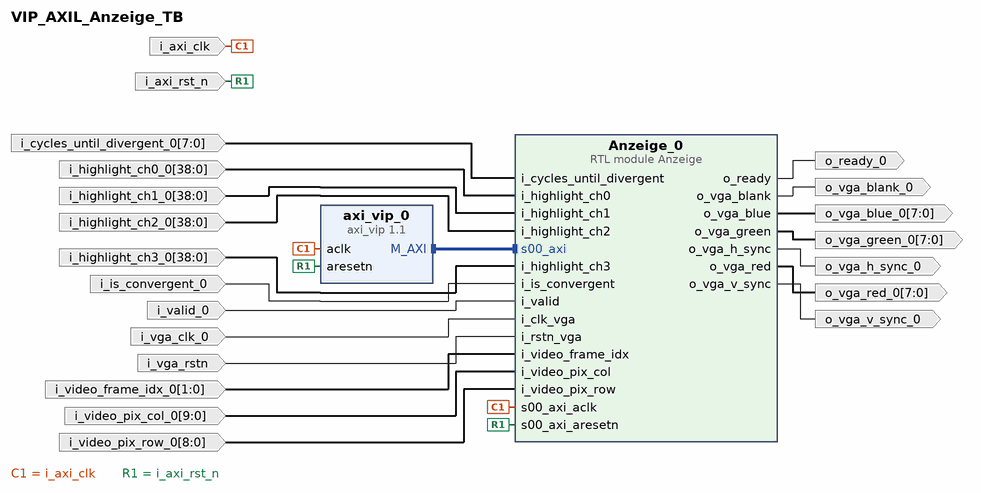
[diagram p0: block diagram of the top level]
# Vivado block design VIP_AXIL_Anzeige_TB, xc7z020clg400-1, Vivado 2023.2
create_bd_design VIP_AXIL_Anzeige_TB

create_bd_port -dir I -from 7 -to 0 i_cycles_until_divergent_0
create_bd_port -dir I i_is_convergent_0
create_bd_port -dir I -from 1 -to 0 i_video_frame_idx_0
create_bd_port -dir I -from 8 -to 0 i_video_pix_row_0
create_bd_port -dir I -from 9 -to 0 i_video_pix_col_0
create_bd_port -dir I i_valid_0
create_bd_port -dir O o_ready_0
create_bd_port -dir O o_vga_h_sync_0
create_bd_port -dir O o_vga_v_sync_0
create_bd_port -dir O o_vga_blank_0
create_bd_port -dir O -from 7 -to 0 o_vga_red_0
create_bd_port -dir O -from 7 -to 0 o_vga_green_0
create_bd_port -dir O -from 7 -to 0 o_vga_blue_0
create_bd_port -dir I -type clk i_vga_clk_0
set_property -dict {CONFIG.ASSOCIATED_RESET i_vga_rstn} [get_bd_ports i_vga_clk_0]
create_bd_port -dir I -type rst i_vga_rstn
set_property -dict {CONFIG.POLARITY ACTIVE_HIGH} [get_bd_ports i_vga_rstn]
create_bd_port -dir I -type clk i_axi_clk
set_property -dict {CONFIG.CLK_DOMAIN VIP_AXIL_Anzeige_TB_sim_clk_gen_1_0_clk CONFIG.FREQ_HZ 100000000} [get_bd_ports i_axi_clk]
create_bd_port -dir I -type rst i_axi_rst_n
create_bd_port -dir I -from 38 -to 0 i_highlight_ch0_0
create_bd_port -dir I -from 38 -to 0 i_highlight_ch1_0
create_bd_port -dir I -from 38 -to 0 i_highlight_ch3_0
create_bd_port -dir I -from 38 -to 0 i_highlight_ch2_0

create_bd_cell -type ip -vlnv xilinx.com:ip:axi_vip:1.1 axi_vip_0
set_property -dict [list \
  CONFIG.ADDR_WIDTH 32 \
  CONFIG.DATA_WIDTH 32 \
  CONFIG.HAS_BRESP 1 \
  CONFIG.HAS_PROT 1 \
  CONFIG.HAS_RRESP 1 \
  CONFIG.HAS_WSTRB 1 \
  CONFIG.INTERFACE_MODE MASTER \
  CONFIG.PROTOCOL AXI4LITE \
  CONFIG.READ_WRITE_MODE READ_WRITE \
] [get_bd_cells axi_vip_0]
create_bd_cell -type module -reference Anzeige Anzeige_0

# ---- connections ----

connect_bd_intf_net [get_bd_intf_pins axi_vip_0/M_AXI] [get_bd_intf_pins Anzeige_0/s00_axi]
connect_bd_net [get_bd_pins Anzeige_0/o_ready] [get_bd_ports o_ready_0]
connect_bd_net [get_bd_pins Anzeige_0/o_vga_blank] [get_bd_ports o_vga_blank_0]
connect_bd_net [get_bd_pins Anzeige_0/o_vga_blue] [get_bd_ports o_vga_blue_0]
connect_bd_net [get_bd_pins Anzeige_0/o_vga_green] [get_bd_ports o_vga_green_0]
connect_bd_net [get_bd_pins Anzeige_0/o_vga_h_sync] [get_bd_ports o_vga_h_sync_0]
connect_bd_net [get_bd_pins Anzeige_0/o_vga_red] [get_bd_ports o_vga_red_0]
connect_bd_net [get_bd_pins Anzeige_0/o_vga_v_sync] [get_bd_ports o_vga_v_sync_0]
connect_bd_net -net i_cycles_until_divergent_0_1 [get_bd_ports i_cycles_until_divergent_0] [get_bd_pins Anzeige_0/i_cycles_until_divergent]
connect_bd_net -net i_highlight_ch0_0_1 [get_bd_ports i_highlight_ch0_0] [get_bd_pins Anzeige_0/i_highlight_ch0]
connect_bd_net -net i_highlight_ch1_0_1 [get_bd_ports i_highlight_ch1_0] [get_bd_pins Anzeige_0/i_highlight_ch1]
connect_bd_net -net i_highlight_ch2_0_1 [get_bd_ports i_highlight_ch2_0] [get_bd_pins Anzeige_0/i_highlight_ch2]
connect_bd_net -net i_highlight_ch3_0_1 [get_bd_ports i_highlight_ch3_0] [get_bd_pins Anzeige_0/i_highlight_ch3]
connect_bd_net -net i_is_convergent_0_1 [get_bd_ports i_is_convergent_0] [get_bd_pins Anzeige_0/i_is_convergent]
connect_bd_net -net i_valid_0_1 [get_bd_ports i_valid_0] [get_bd_pins Anzeige_0/i_valid]
connect_bd_net -net i_vga_clk_0_1 [get_bd_ports i_vga_clk_0] [get_bd_pins Anzeige_0/i_clk_vga]
connect_bd_net -net i_vga_rst_1 [get_bd_ports i_vga_rstn] [get_bd_pins Anzeige_0/i_rstn_vga]
connect_bd_net -net i_video_frame_idx_0_1 [get_bd_ports i_video_frame_idx_0] [get_bd_pins Anzeige_0/i_video_frame_idx]
connect_bd_net -net i_video_pix_col_0_1 [get_bd_ports i_video_pix_col_0] [get_bd_pins Anzeige_0/i_video_pix_col]
connect_bd_net -net i_video_pix_row_0_1 [get_bd_ports i_video_pix_row_0] [get_bd_pins Anzeige_0/i_video_pix_row]
connect_bd_net -net sim_clk_gen_1_AXI_clk [get_bd_ports i_axi_clk] [get_bd_pins Anzeige_0/s00_axi_aclk] [get_bd_pins axi_vip_0/aclk]
connect_bd_net -net sim_clk_gen_1_AXI_sync_rst [get_bd_ports i_axi_rst_n] [get_bd_pins Anzeige_0/s00_axi_aresetn] [get_bd_pins axi_vip_0/aresetn]

# ---- address map ----
assign_bd_address -offset 0x00000000 -range 4K -target_address_space [get_bd_addr_spaces axi_vip_0/Master_AXI] [get_bd_addr_segs Anzeige_0/s00_axi/reg0]

validate_bd_design
save_bd_design
